# Altium schematic sheet AltiumSchematicSheet.SchDoc
size B; SheetNumber: 1; SheetTotal: 1
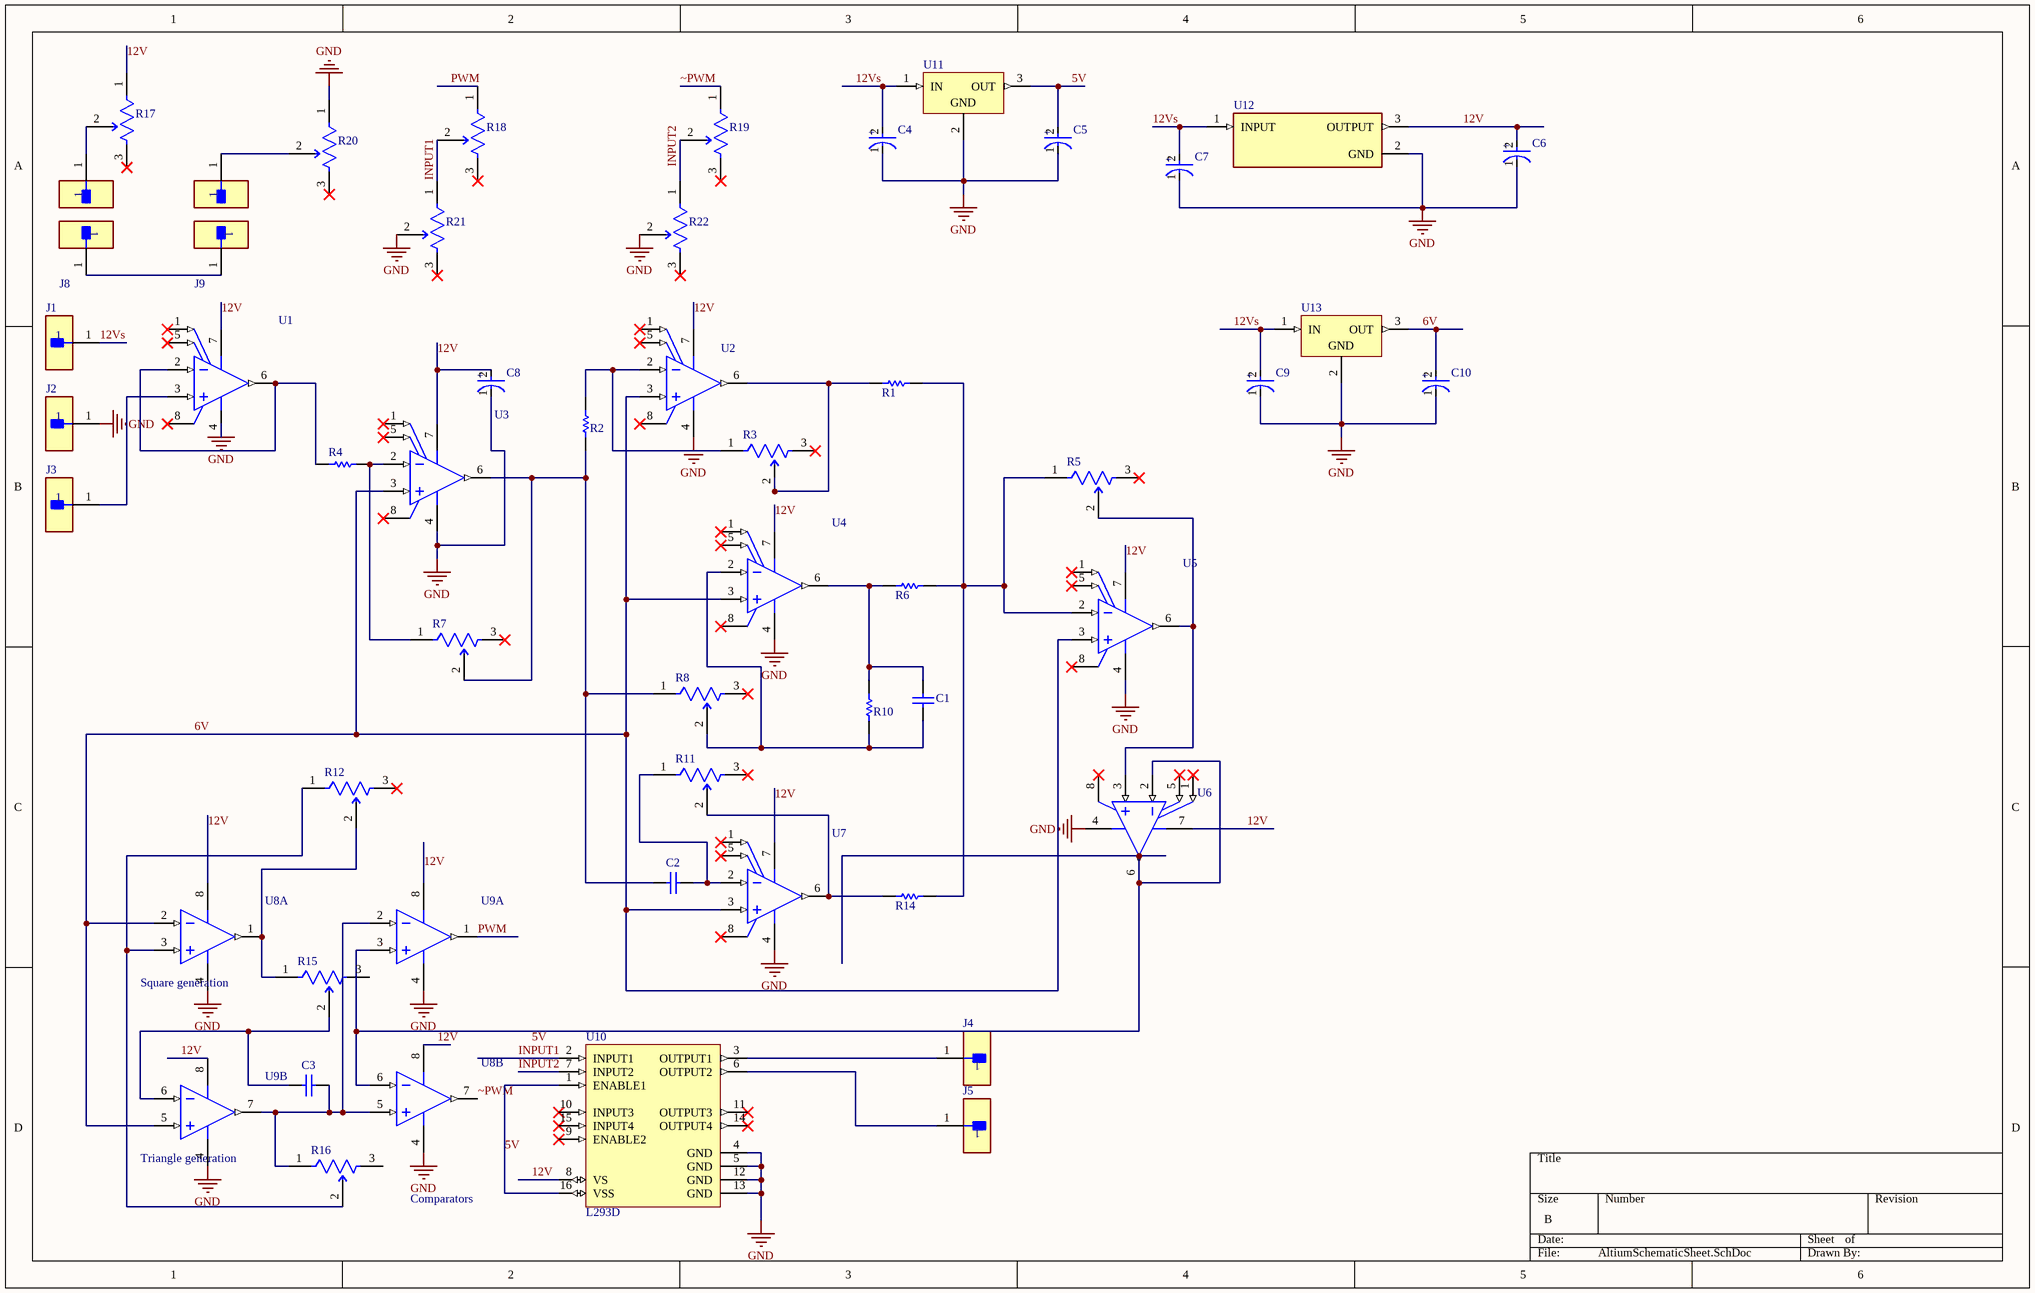
[diagram p0: AltiumSchematicSheet.SchDoc]

## Parts
C1  C330C105M5U5TA  [KEMT-C330C105M5U5TA]  (value not drawn)
C2  C330C105M5U5TA  [KEMT-C330C105M5U5TA]  (value not drawn)
C3  C330C105M5U5TA  [KEMT-C330C105M5U5TA]  (value not drawn)
C4  EEUFK1C472L  [FP-RAD-TH-D_12_5_0_5-L_40-MFG]  (value not drawn)
C5  EEUFK1C472L  [FP-RAD-TH-D_12_5_0_5-L_40-MFG]  (value not drawn)
C6  EEUFK1C472L  [FP-RAD-TH-D_12_5_0_5-L_40-MFG]  (value not drawn)
C7  EEUFK1C472L  [FP-RAD-TH-D_12_5_0_5-L_40-MFG]  (value not drawn)
C8  EEUFK1C472L  [FP-RAD-TH-D_12_5_0_5-L_40-MFG]  (value not drawn)
C9  EEUFK1C472L  [FP-RAD-TH-D_12_5_0_5-L_40-MFG]  (value not drawn)
C10  EEUFK1C472L  [FP-RAD-TH-D_12_5_0_5-L_40-MFG]  (value not drawn)
J1  PBC01SAAN  [FP-PBC01SAAN-MFG]  (value not drawn)
J2  PBC01SAAN  [FP-PBC01SAAN-MFG]  (value not drawn)
J3  PBC01SAAN  [FP-PBC01SAAN-MFG]  (value not drawn)
J4  PBC01SAAN  [FP-PBC01SAAN-MFG]  (value not drawn)
J5  PBC01SAAN  [FP-PBC01SAAN-MFG]  (value not drawn)
J6  PBC01SAAN  [FP-PBC01SAAN-MFG]  (value not drawn)
J7  PBC01SAAN  [FP-PBC01SAAN-MFG]  (value not drawn)
J8  PBC01SAAN  [FP-PBC01SAAN-MFG]  (value not drawn)
J9  PBC01SAAN  [FP-PBC01SAAN-MFG]  (value not drawn)
R1  MFR-25FBF52-47K5  [RESA60-630X240]  (value not drawn)
R2  MFR-25FBF52-47K5  [RESA60-630X240]  (value not drawn)
R3  3296W-1-501LF  [FP-3296W-MFG]  (value not drawn)
R4  MFR-25FBF52-47K5  [RESA60-630X240]  (value not drawn)
R5  3296W-1-501LF  [FP-3296W-MFG]  (value not drawn)
R6  MFR-25FBF52-47K5  [RESA60-630X240]  (value not drawn)
R7  3296W-1-501LF  [FP-3296W-MFG]  (value not drawn)
R8  3296W-1-501LF  [FP-3296W-MFG]  (value not drawn)
R10  MFR-25FBF52-47K5  [RESA60-630X240]  (value not drawn)
R11  3296W-1-501LF  [FP-3296W-MFG]  (value not drawn)
R12  3296W-1-501LF  [FP-3296W-MFG]  (value not drawn)
R14  MFR-25FBF52-47K5  [RESA60-630X240]  (value not drawn)
R15  3296W-1-501LF  [FP-3296W-MFG]  (value not drawn)
R16  3296W-1-501LF  [FP-3296W-MFG]  (value not drawn)
R17  3296W-1-501LF  [FP-3296W-MFG]  (value not drawn)
R18  3296W-1-501LF  [FP-3296W-MFG]  (value not drawn)
R19  3296W-1-501LF  [FP-3296W-MFG]  (value not drawn)
R20  3296W-1-501LF  [FP-3296W-MFG]  (value not drawn)
R21  3296W-1-501LF  [FP-3296W-MFG]  (value not drawn)
R22  3296W-1-501LF  [FP-3296W-MFG]  (value not drawn)
U1  UA741CP  [P0008A]  (value not drawn)
U2  UA741CP  [P0008A]  (value not drawn)
U3  UA741CP  [P0008A]  (value not drawn)
U4  UA741CP  [P0008A]  (value not drawn)
U5  UA741CP  [P0008A]  (value not drawn)
U6  UA741CP  [P0008A]  (value not drawn)
U7  UA741CP  [P0008A]  (value not drawn)
U8  TL072CP  [P0008A]  (value not drawn)  (parts A,B of 2)
U9  TL072CP  [P0008A]  (value not drawn)  (parts A,B of 2)
U10  L293D  [STM-L293D-16]
U11  LM7805CT  [FAIR-TO-220-3]  (value not drawn)
U12  LM7812CT  [FP-TO220B03-MFG]  (value not drawn)
U13  LM7805CT  [FAIR-TO-220-3]  (value not drawn)

## Nets
GND: C4.1(C) C5.1(C) C6.1(C) C7.1(C) C8.1(C) C9.1(C) C10.1(C) J2.1 R20.1(CCW) R21.2(WIPER) R22.2(WIPER) U1.4(VCC-) U2.4(VCC-) U3.4(VCC-) U4.4(VCC-) U5.4(VCC-) U6.4(VCC-) U7.4(VCC-) U8.4(VCC-) U9.4(VCC-) U10.4(GND) U10.5(GND) U10.12(GND) U10.13(GND) U11.2(GND) U12.2(GND) U13.2(GND)
5V: C5.2(A) U10.1(ENABLE1) U10.16(VSS) U11.3(OUT)
6V: C10.2(A) U2.3(IN+) U3.3(IN+) U4.3(IN+) U5.3(IN+) U7.3(IN+) U8.2(IN1-) U9.5(IN2+) U13.3(OUT)
12V: C6.2(A) C8.2(A) R17.1(CCW) U1.7(VCC+) U2.7(VCC+) U3.7(VCC+) U4.7(VCC+) U5.7(VCC+) U6.7(VCC+) U7.7(VCC+) U8.8(VCC+) U9.8(VCC+) U10.8(VS) U12.3(OUTPUT)
12Vs: C4.2(A) C7.2(A) C9.2(A) J1.1 U11.1(IN) U12.1(INPUT) U13.1(IN)
INPUT1: R18.2(WIPER) R21.1(CCW) U10.2(INPUT1)
INPUT2: R19.2(WIPER) R22.1(CCW) U10.7(INPUT2)
PWM: R18.1(CCW) U9.1(OUT1)
~PWM: R19.1(CCW) U8.7(OUT2)
NetC1_1: C1.1 R8.2(WIPER) R10.1 U4.2(IN-)
NetC1_2: C1.2 R6.2 R10.2 U4.6(OUT)
NetC2_1: C2.1 R11.1(CCW) U7.2(IN-)
NetC2_2: C2.2 R2.1 R7.2(WIPER) R8.1(CCW) U3.6(OUT)
NetC3_1: C3.1 R16.1(CCW) U8.5(IN2+) U9.2(IN1-) U9.7(OUT2)
NetC3_2: C3.2 R15.2(WIPER) U9.6(IN2-)
NetJ3_1: J3.1 U1.3(IN+)
NetJ4_1: J4.1 U10.3(OUTPUT1)
NetJ5_1: J5.1 U10.6(OUTPUT2)
NetJ6_1: J6.1 R17.2(WIPER)
NetJ7_1: J7.1 R20.2(WIPER)
NetJ8_1: J8.1 J9.1
NetR1_1: R1.1 R5.1(CCW) R6.1 R14.1 U5.2(IN-)
NetR1_2: R1.2 R3.2(WIPER) U2.6(OUT)
NetR2_2: R2.2 R3.1(CCW) U2.2(IN-)
NetR4_1: R4.1 U1.2(IN-) U1.6(OUT)
NetR4_2: R4.2 R7.1(CCW) U3.2(IN-)
NetR5_2: R5.2(WIPER) U5.6(OUT) U6.3(IN+)
NetR11_2: R11.2(WIPER) R14.2 U7.6(OUT)
NetR12_1: R12.1(CCW) R16.2(WIPER) U8.3(IN1+)
NetR12_2: R12.2(WIPER) R15.1(CCW) U8.1(OUT1)
NetU6_2: U6.2(IN-) U6.6(OUT) U8.6(IN2-) U9.3(IN1+)

Not connected (* = marked no-connect by the designer): R3 3(CW)*; R5 3(CW)*; R7 3(CW)*; R8 3(CW)*; R11 3(CW)*; R12 3(CW)*; R15 3(CW); R16 3(CW); R17 3(CW)*; R18 3(CW)*; R19 3(CW)*; R20 3(CW)*; R21 3(CW)*; R22 3(CW)*; U1 1(OFFSET_N1)* 5(OFFSET_N2)* 8(NC)*; U2 1(OFFSET_N1)* 5(OFFSET_N2)* 8(NC)*; U3 1(OFFSET_N1)* 5(OFFSET_N2)* 8(NC)*; U4 1(OFFSET_N1)* 5(OFFSET_N2)* 8(NC)*; U5 1(OFFSET_N1)* 5(OFFSET_N2)* 8(NC)*; U6 1(OFFSET_N1)* 5(OFFSET_N2)* 8(NC)*; U7 1(OFFSET_N1)* 5(OFFSET_N2)* 8(NC)*; U10 9(ENABLE2)* 10(INPUT3)* 11(OUTPUT3)* 14(OUTPUT4)* 15(INPUT4)*

## Notes on the sheet
- (near U8) Square generation
- (near U9) Triangle generation
- Comparators
- Labels drawn without touching a wire or pin: 5V
- (in symbol CMP-05427-001252-1) +

## Library data of the parts
C1-C3 = CMP-2000-06056-1: Ceramic Capacitor, 1 uF, +/- 20%, 50 V, -10 to 85 degC, 2-Pin THD, RoHS, Bulk; Manufacturer: Kemet; Voltage - Rated: 50V; Temperature Coefficient: Z5U; Catalog Drawings: C330(std); Product Training Modules: CapacitorBasics-TypicalUsesforCapacitors; Capacitance: 1µF; Online Catalog: GoldenMax™Series; Other Names: 399-4390; PCN Design/Specification: C3yySeriesGoldenMaxLeadConfiguration02/Feb/2015; Thickness (Max): -; Size / Dimension: 0.300"Lx0.150"W(7.62mmx3.81mm); Mounting Technology: ThroughHole; Tolerance: ±20%; Mounting Type: ThroughHole; Datasheet URL: http://www.kemet.com/Lists/ProductCatalog/Attachments/599/KEM_C1051_GOLDMAX_Z5U.pdf; Series: GoldenMax™; Standard Package: 250; Ratings: -; Applications: GeneralPurpose; Package Reference: C330C105M5U5TA; Packaging: Bulk; Category: Capacitors; Package Description: 2-Pin Through Hole Device, Body 7.11 x 4.07 mm; Operating Temperature: 10°C~85°C; Height - Seated (Max): 0.360"(9.14mm); Manufacturer URL: http://www.kemet.com/; Lead Spacing: 0.200"(5.08mm); Features: -; Lead Style: Straight; Package / Case: Radial; Family: CeramicCapacitors; Datasheet Version: 12/2015
C4-C10 = CMP-05427-001252-1: Aluminum Electrolytic Capacitors (Radial Lead Type) AEC-Q200 Qualified 4700uF ±20% 16V; Dielectric Material: Aluminium; Impedance: 14mR; Capacitance: 4.7mF; Life (Hours): 5000Hour; Lead Diameter: 0.8mm; Ripple Current: 3.01A; Voltage: 16V; Voltage Rating: 16V; Lead Pitch: 5mm; Construction: RADIAL; Voltage Rating (DC): 16V; Tolerance: 20%; Case/Package: Radial; Mount: Through Hole; Radiation Hardening: No; Min Operating Temperature: -55°C; RoHS Compliant: Yes; Series: FK Radial; Height: 40mm; Termination: Radial; REACH SVHC: No SVHC; Packaging: Bulk; Diameter: 12.5mm; Number of Pins: 2; Max Operating Temperature: 105°C
J1-J9 = CMP-25680-000032-1: CONN HEADER VERT 1POS; Number of Positions: 1; Connector Type: Male Pin; Gender: Male; Pitch: 2.54mm; Contact Material: Bronze; Mount: Through Hole; Length: 2.54mm; Height: 2.54mm; Lead Free: Lead Free; Number of Rows: 1; Contact Plating: Gold; Number of Contacts: 1; Housing Material: Plastic; Termination: Solder; Package Quantity: 1; Packaging: Bulk; Color: Black; Contact Mating Length: 0.23inch; Housing Color: Black; Width: 2.54mm
R1 R2 R4 R6 R10 R14 = CMP-1659-00063-1: Axial Resistor, 47.5 KOhm, +/- 1%, 0.25 W, -55 to 155 degC, 2-Pin THD, RoHS, Bulk; Tolerance: 20%; Shielding: Shielded; Current Rating: 1.3 A; Case\Package: 1008; ComponentLink1Description: Manufacturer URL; Packaging: Tape and Reel; ComponentLink2Description: Datasheet; Radiation Hardening: No; ComponentLink2URL: http://www.yageo.com/documents/recent/Yageo%20LR_MFR_2013.pdf; Min Operating Temperature: -55 degC; Mount: Surface Mount; Width: 2 mm; Length: 2.5 mm; Max Operating Temperature: 125 degC; PackageReference: MFR-25; Height: 1.2 mm; ComponentLink1URL: http://www.yageo.com/; DatasheetVersion: Apr-13; RoHSCompliant: true; Package Quantity: 3000; Case Code (Metric): 2520; PackageDescription: 2-Pin Axial Lead, Dia 2.4 mm, Body Length 6.3 mm
R3 R5 R7 R8 R11 R12 R15-R22 = CMP-07234-000046-1: TRIMMER 500 OHM 0.5W PC PIN TOP; Resistance: 500R; Temperature Coefficient: 100ppm/°C; Resistance Tolerance: 10%; Number of Turns: 25; Max Power Dissipation: 500mW; Packaging: Rail/Tube; Color: Blue; Technology: CERMET; Max Operating Temperature: 125°C; RoHS Compliant: Yes; Radiation Hardening: No; Series: 3296; Military Standard: Not; Width: 9.53mm; Weight: 0.03oz; Length: 9.53mm; Package Quantity: 50; Height: 0.395inch; Min Operating Temperature: -55°C; Lead Free: Lead Free; Mount: Through Hole; Depth: 4.83mm; Termination: Pin; Taper: Linear; Contact Plating: Tin; Resistor Type: Cermet; Tolerance: 10%; REACH SVHC: No SVHC; Power Rating: 500mW
U1-U7 = CMP-0017-00973-2: General-Purpose Operational Amplifier, 7 to 36 V, 0 to 70 degC, 8-pin DIP (P8), Pb-Free (RoHS); Manufacturer: Texas Instruments; Iq per channel(Max)(mA): 2.8; Number of Channels: 1; Total Supply Voltage(Min)(+5V is 5, +/-5V is 10): 7; IIB(Max)(pA): 800000; Slew Rate(Typ)(V/us): 0.5; Total Supply Voltage(Max)(+5V is 5, +/-5V is 10): 36; Vio (25C)(Max)(mV): 6; CMRR(Min)(dB): 70; Sub Family: General Purpose Amplifier, High Supply Voltage Amplifier (>=30V); PackageVersion: 4040082/E, 04/2010; PackageReference: P0008A; ComponentLink1URL: http://www.ti.com/; Mounting Technology: Through Hole; ComponentLink1Description: Manufacturer URL; GBW(Typ)(MHz): 1; ComponentLink2Description: Datasheet; ComponentLink2URL: http://www.ti.com/lit/ds/symlink/ua741.pdf; PartNumber: UA741CP; Code_JEDEC: MS-001; ComponentLink3Description: Package Specification; DatasheetVersion: SLOS094B; ComponentLink3URL: http://www.ti.com/litv/pdf/mpdi001b; PackageDescription: 8-Pin Plastic In-Line, Body 9.59 x 6.35 mm, Pitch 2.54 mm; Eco-Plan: Pb-Free (RoHS)
U8 U9 = CMP-0017-00950-2: Dual Low-Noise JFET-Input General-Purpose Operational Amplifier, 7 to 36 V, 0 to 70 degC, 8-pin DIP (P8), Pb-Free (RoHS); Manufacturer: Texas Instruments; Sub Family: General Purpose Amplifier, High Supply Voltage Amplifier (>=30V); Total Supply Voltage(Max)(+5V is 5, +/-5V is 10): 36; Slew Rate(Typ)(V/us): 13; Vn at 1kHz(Typ)(nV/rtHz): 18; GBW(Typ)(MHz): 3; CMRR(Min)(dB): 70; Total Supply Voltage(Min)(+5V is 5, +/-5V is 10): 7; Vio (25C)(Max)(mV): 10; Rating: Catalog; IIB(Max)(pA): 200; Iq per channel(Max)(mA): 2.5; Number of Channels: 2; Mounting Technology: Through Hole; ComponentLink3Description: Package Specification; PartNumber: TL072CP; PackageVersion: 4040082/E, 04/2010; Eco-Plan: Pb-Free (RoHS); DatasheetVersion: SLOS080J; Offset Drift(Typ)(uV/C): 18; ComponentLink3URL: http://www.ti.com/litv/pdf/mpdi001b; PackageDescription: 8-Pin Plastic In-Line, Body 9.59 x 6.35 mm, Pitch 2.54 mm; Code_JEDEC: MS-001; ComponentLink2URL: http://www.ti.com/lit/ds/symlink/tl072.pdf; ComponentLink1Description: Manufacturer URL; ComponentLink2Description: Datasheet; ComponentLink1URL: http://www.ti.com/; PackageReference: P0008A
U10 = CMP-2000-06524-1: Push-Pull Four Channel Driver with Diode, 4.5 to 36 V, -40 to 150 degC, 16-Pin PDIP, RoHS, Tube; Manufacturer: STMicroelectronics; Number of Outputs: 4; Current - Peak Output: 1.2A; Current - Output / Channel: 600mA; Input Type: Non-Inverting; Other Related Documents: L293DViewAllSpecifications; Dynamic Catalog: HalfBridge; Voltage - Supply: 4.5V~36V; Other Names: 497-2936-5; Package / Case: 16-DIP(0.300",7.62mm); PartNumber: L293D; Operating Temperature: -40°C~150°C; Datasheet URL: http://www.st.com/st-web-ui/static/active/en/resource/technical/document/datasheet/CD00000059.pdf; Supplier Device Package: 16-PowerDIP; Packaging: Tube; Package Description: 16-Pin Thru-Hole Dual-In-Line, Body 20 x 6.85 mm, Pitch 2.54 mm; Standard Package: 25; Datasheet Version: 07/2003; On-State Resistance: -; Manufacturer URL: http://www.st.com/; Category: IntegratedCircuits(ICs); Family: PMIC-MOSFET,BridgeDrivers-InternalSwitch; Type: HalfBridge; Series: -; Mounting Technology: ThroughHole; Package Reference: DIP-16; Mounting Type: ThroughHole
U11 U13 = CMP-2000-04938-1: Positive Voltage Regulator, 5 V, 1 A, -40 to 125 degC, 3-Pin TO-220, RoHS, Tube; Manufacturer: FairchildSemiconductor; Maximum Input Voltage: 35V; Maximum Quiescent Current: 8mA; Load Regulation: 100mV; Maximum Output Current: 2.2(Typ)A; Output Type: Fixed; Typical Dropout Voltage @ Current: 2@1AV; Rad Hard: No; Output Voltage: 5V; Accuracy: ±4%; Number of Outputs: 1; Category: LinearRegulator; Package Description: 3-Pin Through Hole Device, Body 10 x 4.5 mm, Pitch 2.54 mm; Packaging: Rail/Tube; Mounting: ThroughHole; Polarity: Positive; Manufacturer URL: https://www.fairchildsemi.com/; Line Regulation: 100mV; Datasheet Version: Aug-12; Datasheet URL: https://datasheet.ciiva.com/26904/lm7805ct-26904988.pdf; Package Reference: TO-220; Package URL: https://www.fairchildsemi.com/package-drawings/TO/TO220B03.pdf; Package: 3TO-220AB; Operating Temperature: -40to125degC; Type: Linear
U12 = CMP-07128-000015-1: IC REG LINEAR 12V 1A TO220-3; Obsolete Part: true; Manufacturer: ON Semiconductor; Nominal Supply Current: 5.1mA; Output Type: Fixed; Dropout Voltage: 2V; Max Supply Voltage: 35V; Accuracy Percentage: 4%; Standoff Height: 2.7mm; Number Of Outputs: 1; Octopart: https://octopart.com/lm7812ct-on+semiconductor-14383031; Output Current: 1A; ComponentLink2Description: Datasheet; Device Class L1: Integrated Circuits (ICs); Device Class L2: Power Management ICs; Temperature Range Low: -40°C; Category: IC; Package: TO220B03; Device Class L3: Voltage Regulators - Linear; RoHS: TRUE; Digikey Description: IC REG LINEAR 12V 1A TO220-3; Ipc Land Pattern Name: TO-220; Output Voltage: 12V; Temperature: -40°C to +125°C; Automotive: No; Temperature Range High: +125°C; ComponentLink2URL: https://www.mouser.in/datasheet/2/308/LM7812-1125088.pdf; Manufacturer Part Number: LM7812CT; Height: 20.4mm; Lead Free: Yes